# Altium schematic sheet 0272_GPU STRAPS-1.SchDoc
size 848 x 558 mm
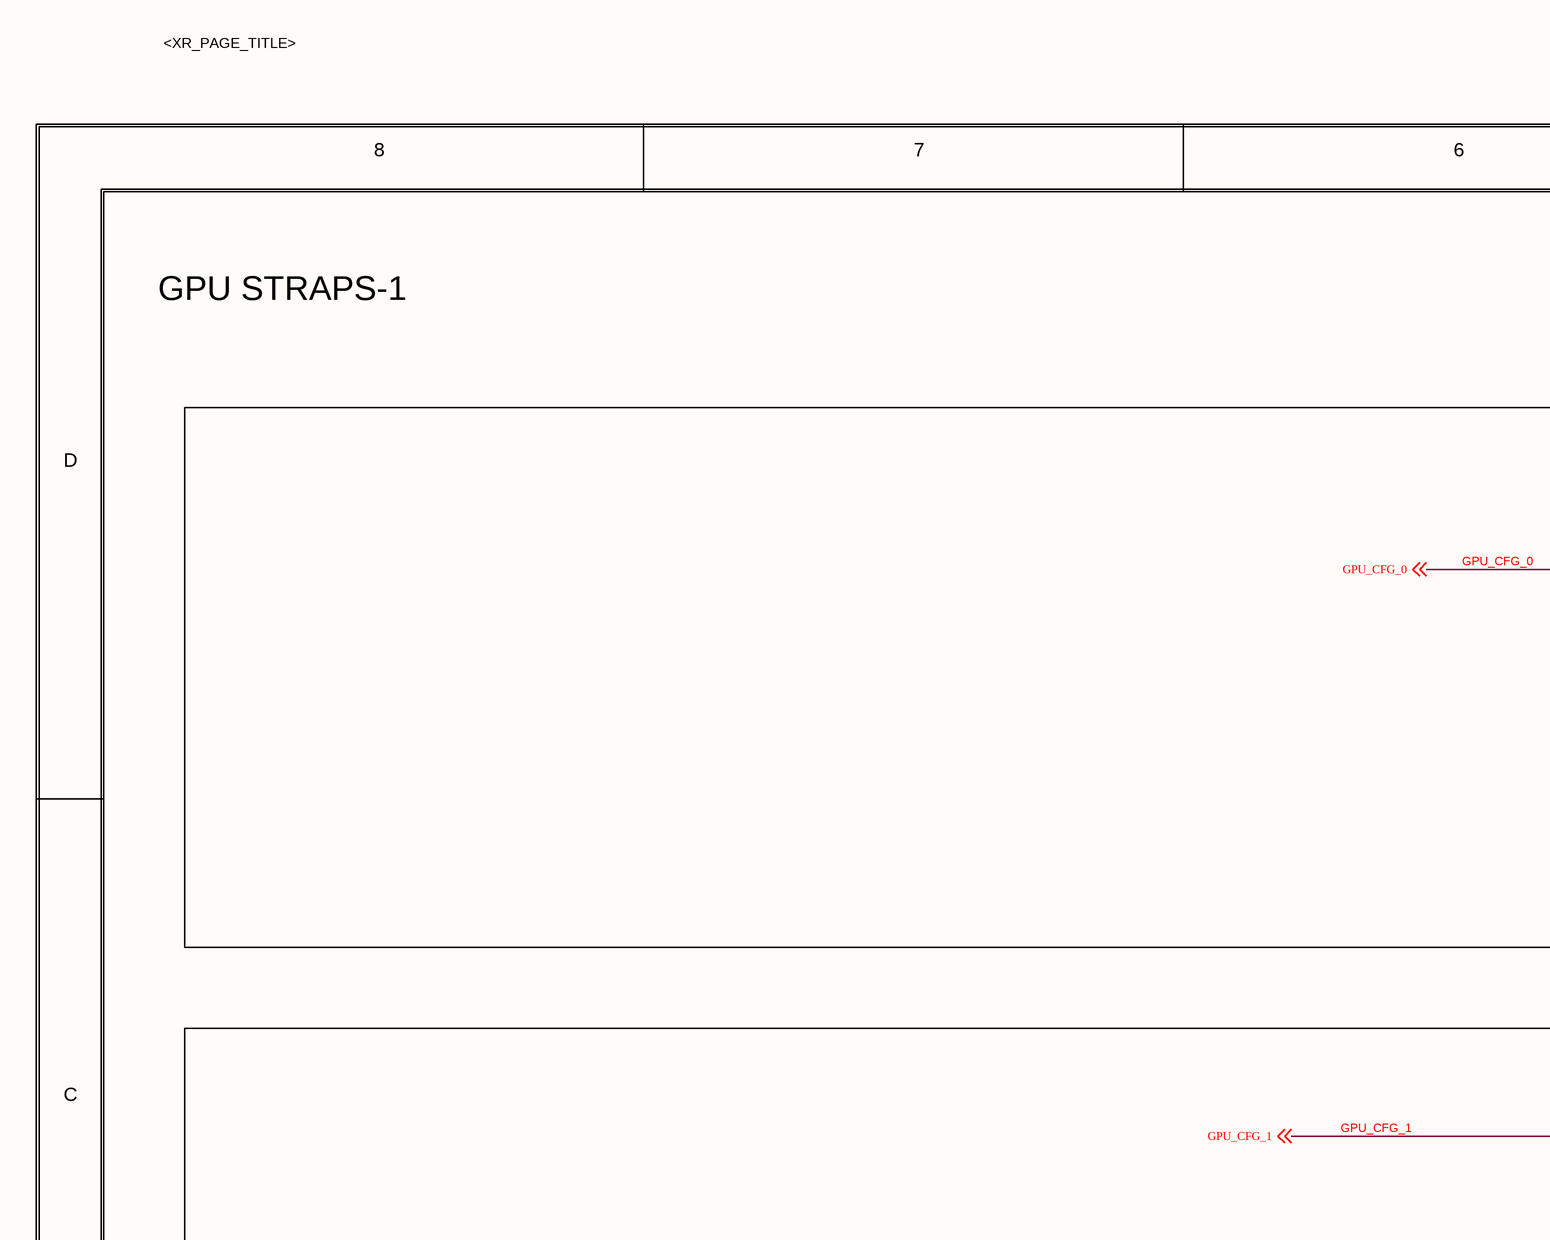
[diagram p0: 0272_GPU STRAPS-1.SchDoc, top left]
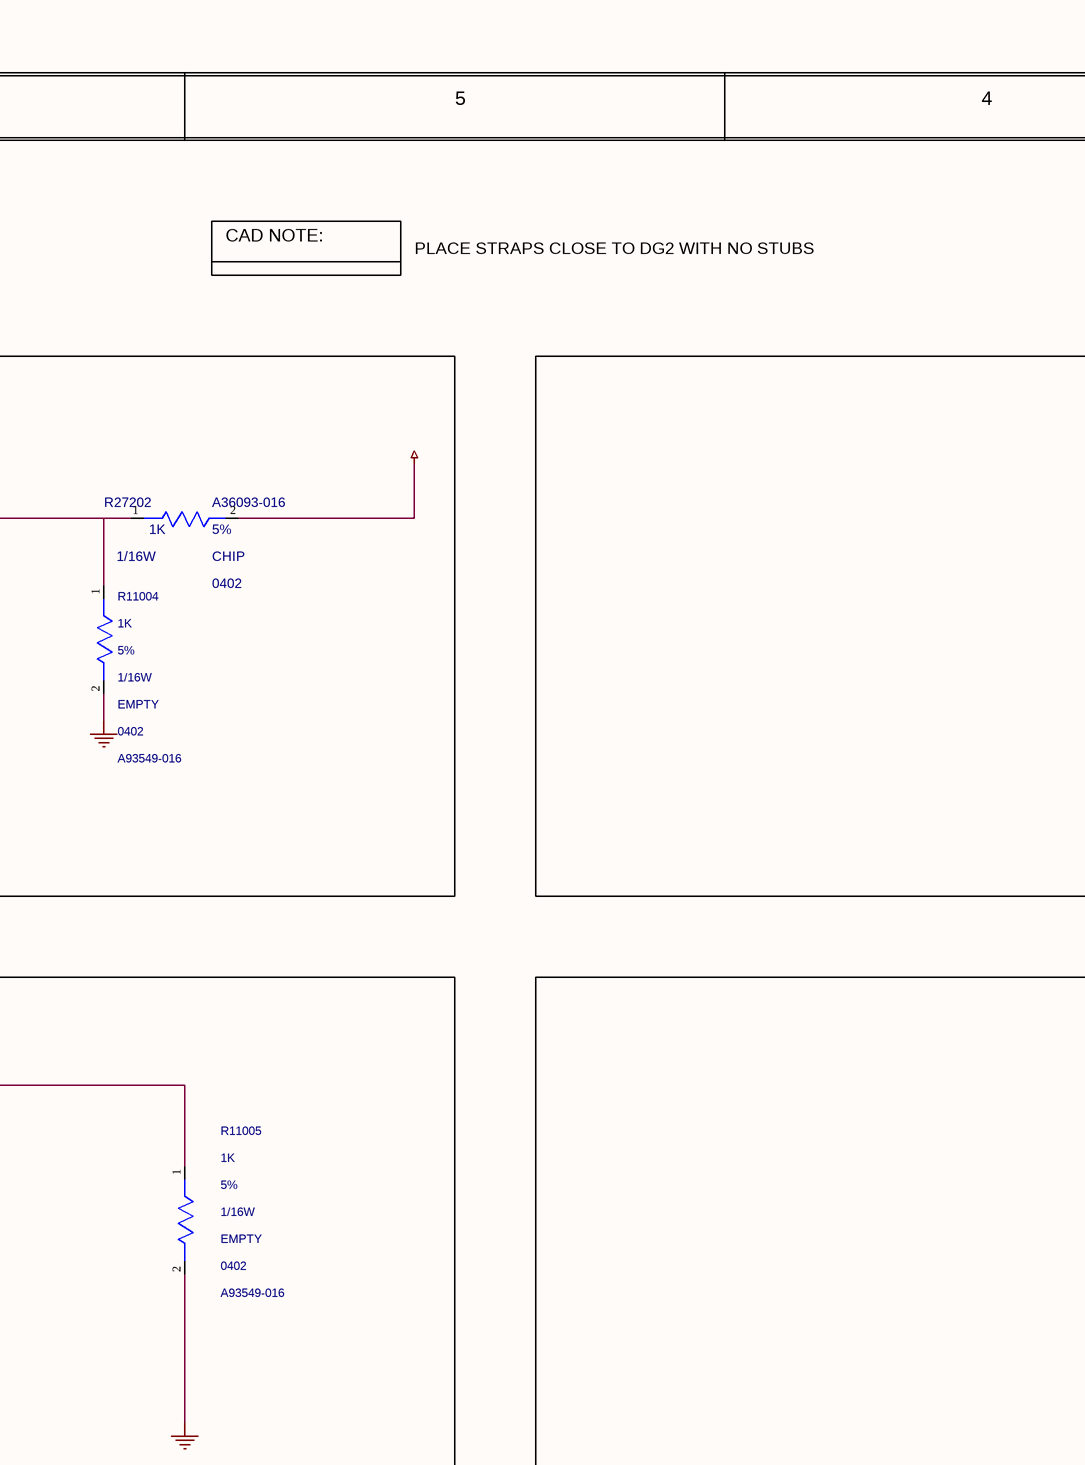
[diagram p1: 0272_GPU STRAPS-1.SchDoc, top middle]
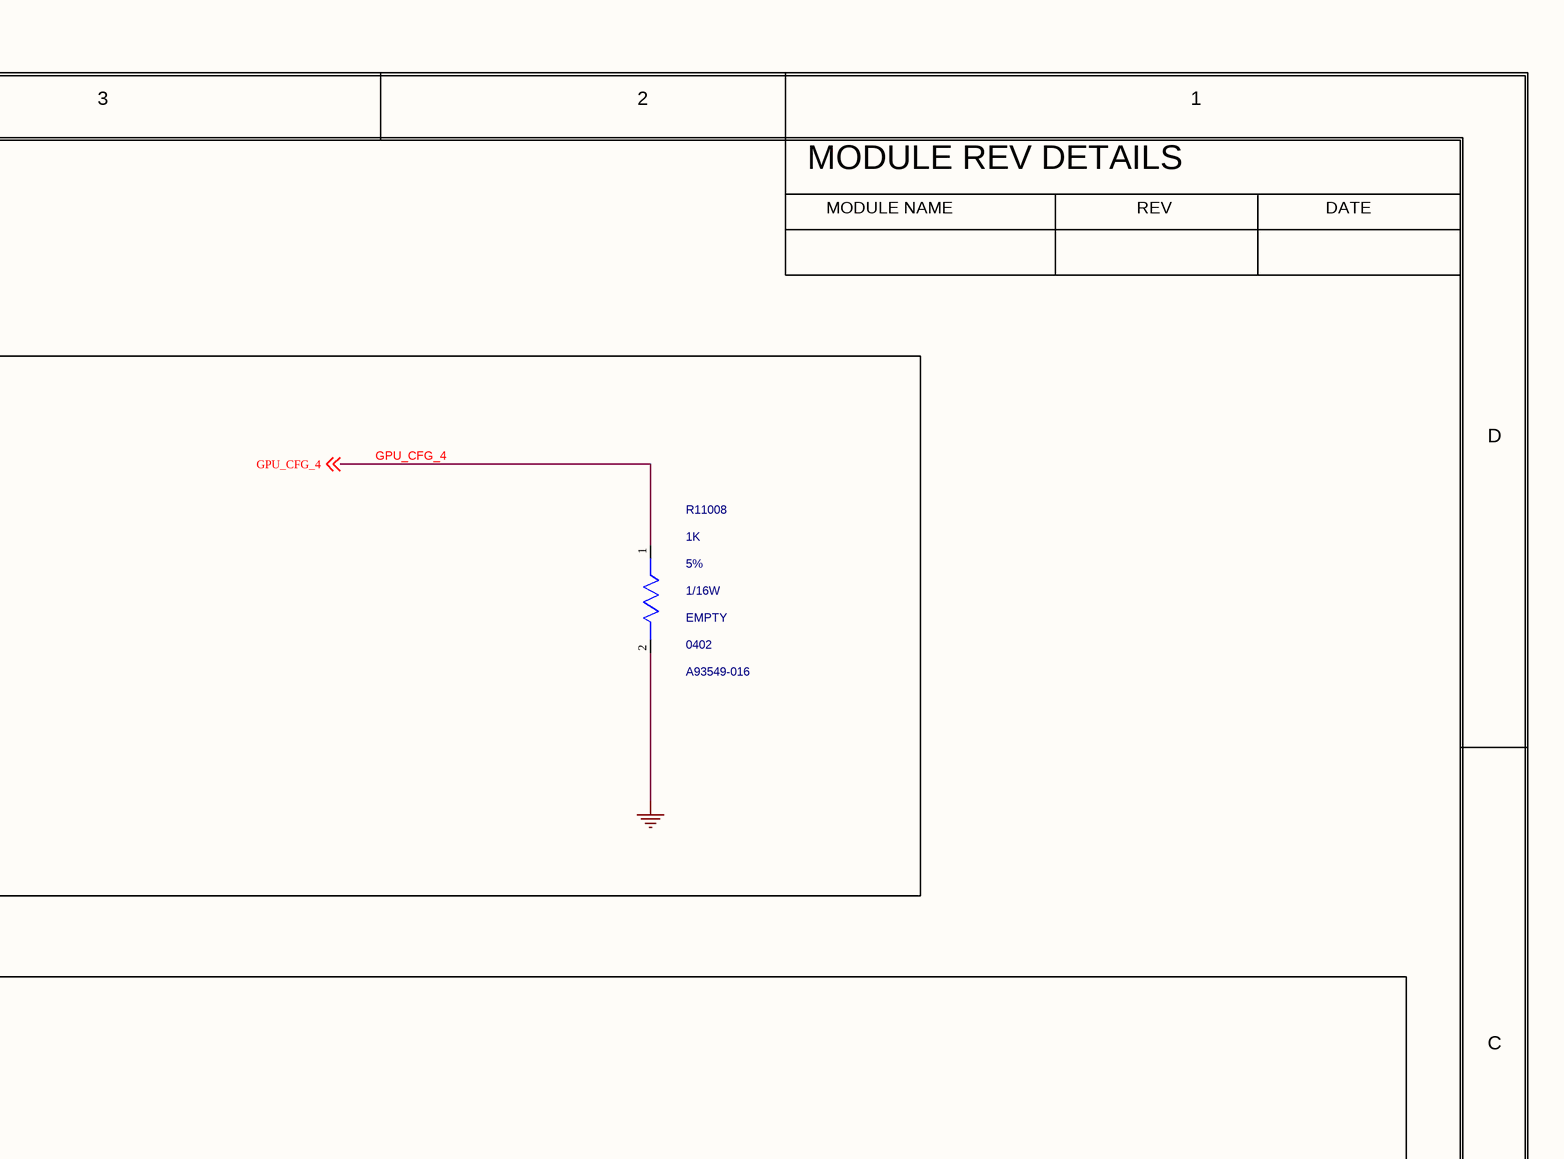
[diagram p2: 0272_GPU STRAPS-1.SchDoc, top right]
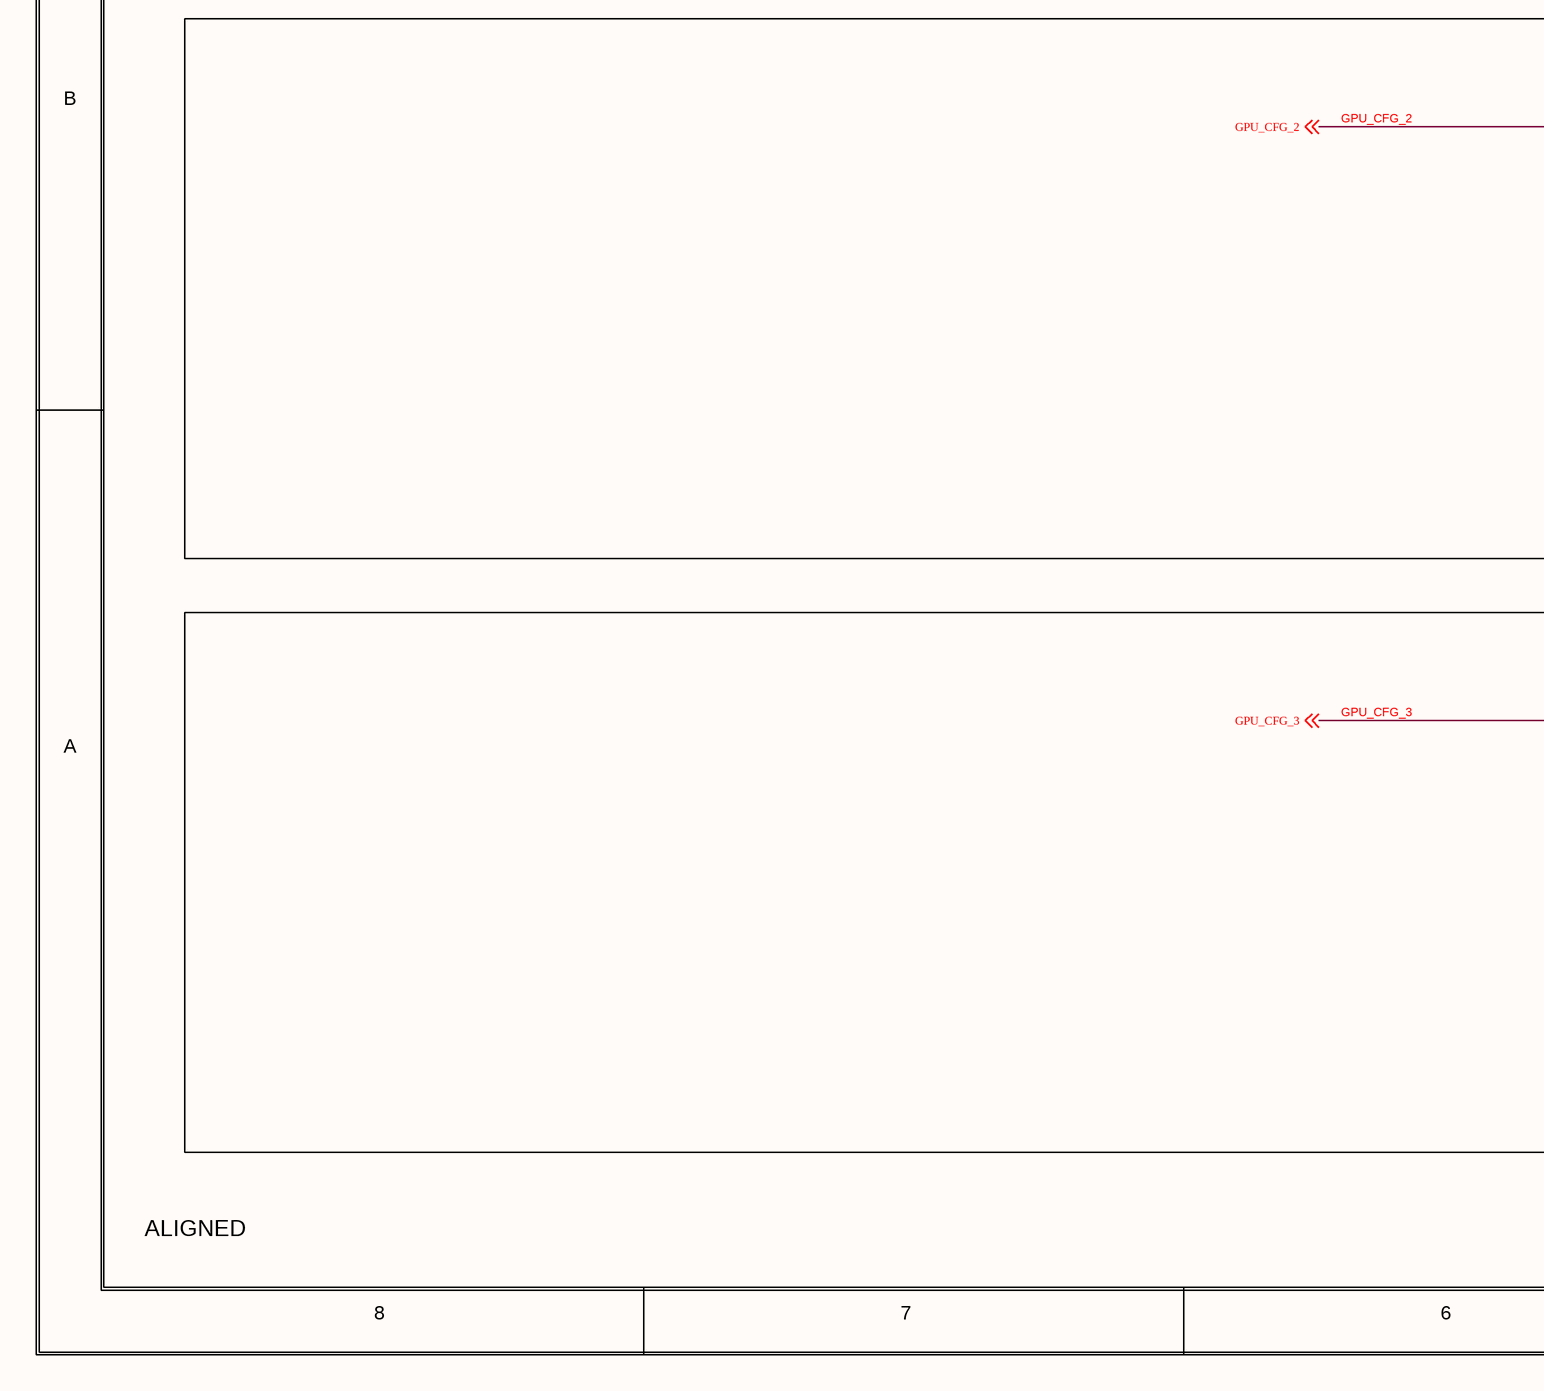
[diagram p3: 0272_GPU STRAPS-1.SchDoc, bottom left]
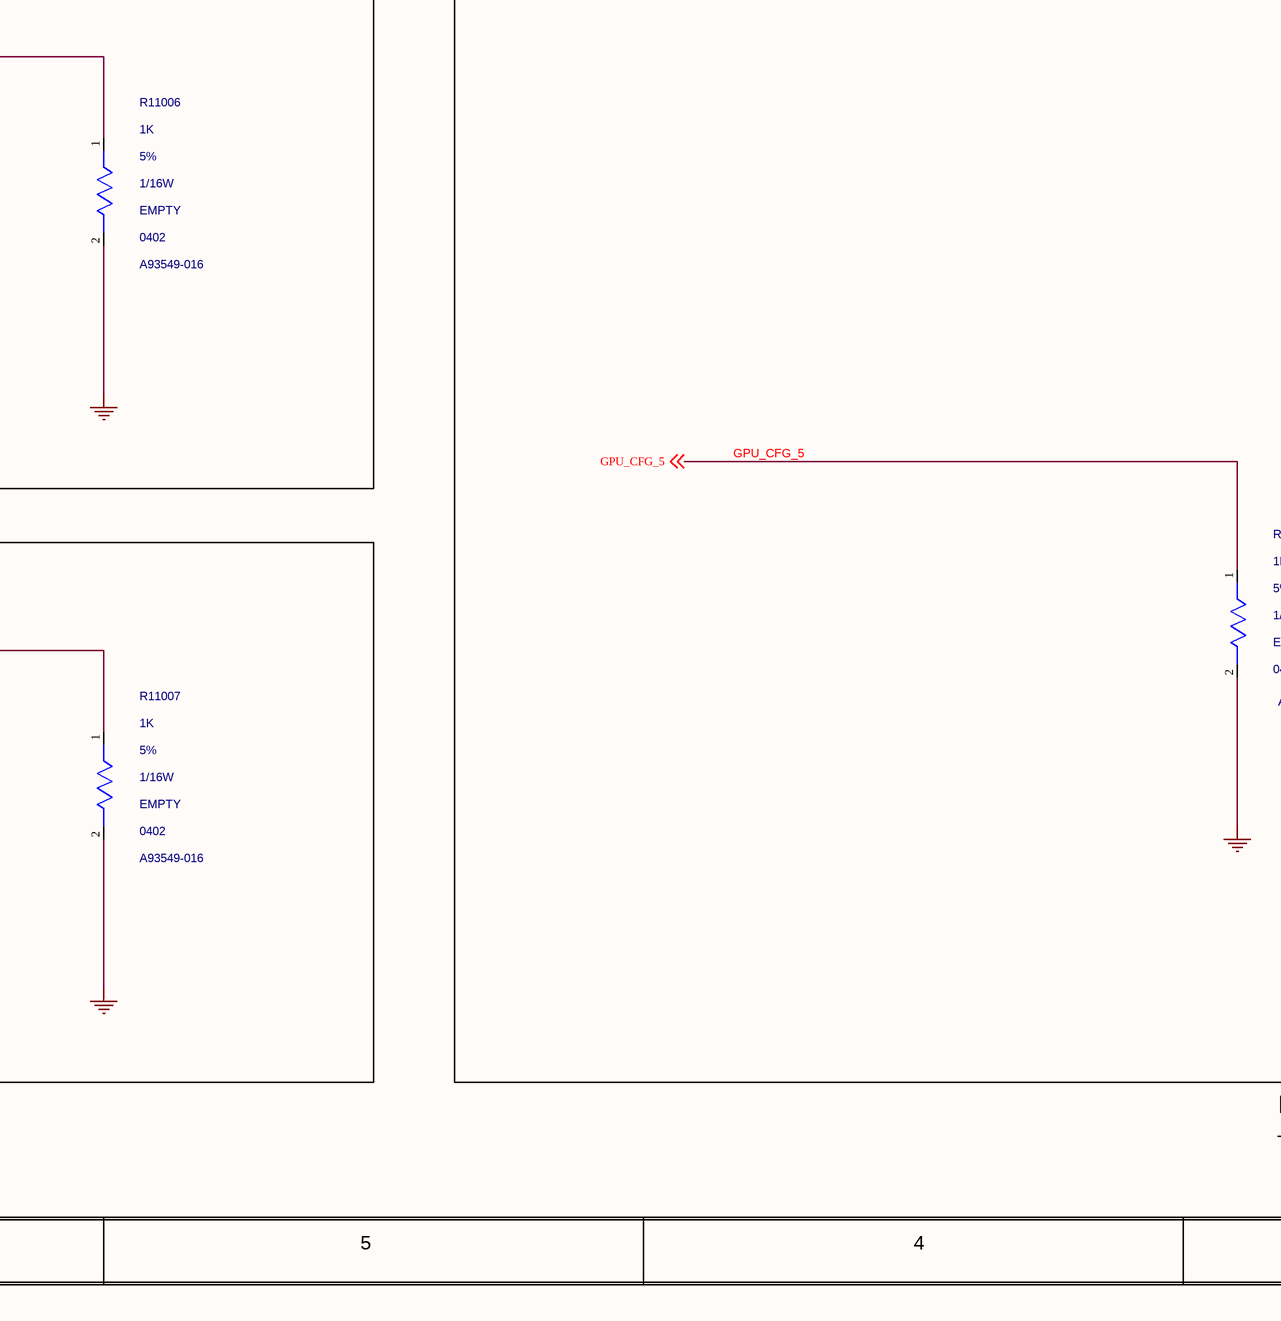
[diagram p4: 0272_GPU STRAPS-1.SchDoc, bottom middle]
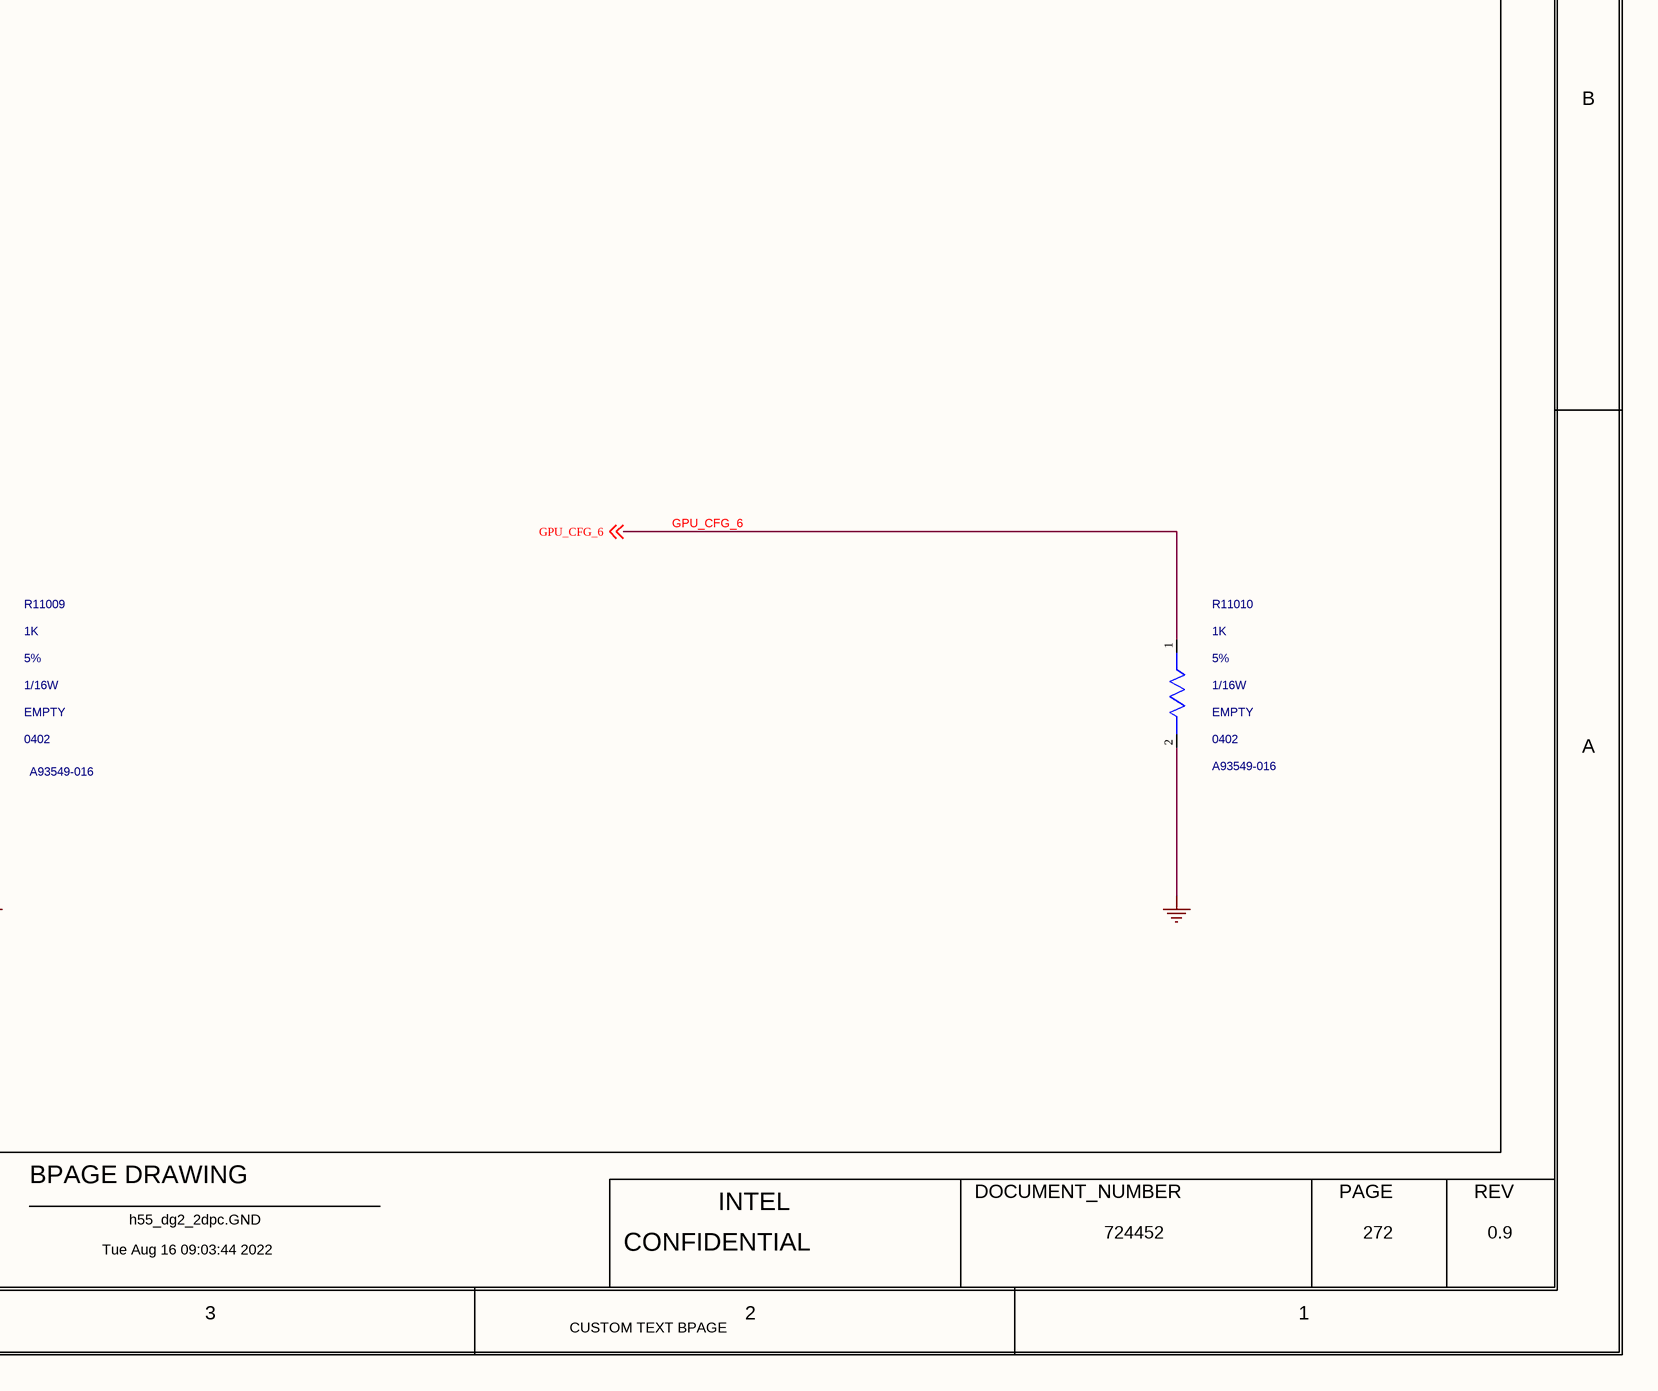
[diagram p5: 0272_GPU STRAPS-1.SchDoc, bottom right]

## Parts
R11004  1K  MATERIAL: EMPTY  PACK_TYPE: 0402  PART_NUMBER: A93549-016  TOLERANCE: 5%  WATTAGE: 1/16W  [SMR0402IA]
R11005  1K  MATERIAL: EMPTY  PACK_TYPE: 0402  PART_NUMBER: A93549-016  TOLERANCE: 5%  WATTAGE: 1/16W  [SMR0402IA]
R11006  1K  MATERIAL: EMPTY  PACK_TYPE: 0402  PART_NUMBER: A93549-016  TOLERANCE: 5%  WATTAGE: 1/16W  [SMR0402IA]
R11007  1K  MATERIAL: EMPTY  PACK_TYPE: 0402  PART_NUMBER: A93549-016  TOLERANCE: 5%  WATTAGE: 1/16W  [SMR0402IA]
R11008  1K  MATERIAL: EMPTY  PACK_TYPE: 0402  PART_NUMBER: A93549-016  TOLERANCE: 5%  WATTAGE: 1/16W  [SMR0402IA]
R11009  1K  MATERIAL: EMPTY  PACK_TYPE: 0402  PART_NUMBER: A93549-016  TOLERANCE: 5%  WATTAGE: 1/16W  [SMR0402IA]
R11010  1K  MATERIAL: EMPTY  PACK_TYPE: 0402  PART_NUMBER: A93549-016  TOLERANCE: 5%  WATTAGE: 1/16W  [SMR0402IA]
R27202  1K  MATERIAL: CHIP  PACK_TYPE: 0402  PART_NUMBER: A36093-016  TOLERANCE: 5%  WATTAGE: 1/16W  [SMR0402IA]

## Nets
+V1P8S_GPU: R27202.2(B)
GND: R11004.2(B) R11005.2(B) R11006.2(B) R11007.2(B) R11008.2(B) R11009.2(B) R11010.2(B)
GPU_CFG_0: R11004.1(A) R27202.1(A) ; off-sheet GPU_CFG_0
GPU_CFG_1: R11005.1(A) ; off-sheet GPU_CFG_1
GPU_CFG_2: R11006.1(A) ; off-sheet GPU_CFG_2
GPU_CFG_3: R11007.1(A) ; off-sheet GPU_CFG_3
GPU_CFG_4: R11008.1(A) ; off-sheet GPU_CFG_4
GPU_CFG_5: R11009.1(A) ; off-sheet GPU_CFG_5
GPU_CFG_6: R11010.1(A) ; off-sheet GPU_CFG_6

## Notes on the sheet
- <XR_PAGE_TITLE>
- 8
- 7
- 6
- 5
- 4
- 3
- 2
- 1
- MODULE REV DETAILS
- GPU STRAPS-1
- CAD NOTE:
- PLACE STRAPS CLOSE TO DG2 WITH NO STUBS
- MODULE NAME
- REV
- DATE
- D
- C
- B
- A
- BPAGE DRAWING
- INTEL
- DOCUMENT_NUMBER
- PAGE
- ALIGNED
- Tue Aug 16 09:03:44 2022
- h55_dg2_2dpc.GND
- CONFIDENTIAL
- 724452
- 272
- 0.9
- CUSTOM TEXT BPAGE

## Library data of the parts
R11004 = RES: CDS_PHYS_PART_NAME: RES_0402-A93549-016,EMPTY,1K,5%,1/16W,LPDB,GENERIC; OriginalSymbolOrigin: (-25,75); XY: (-5150,4075); VER: 2; ROT: 0; PHYS_PAGE: 272; LOCATION: R11004; DRAWING: @RVP1_ADL_SB_ADP_S_DDR5_SODIMM_2DPC_LIB.H55_DG2_2DPC(SCH_1):PAGE445; CDS_LIB: discrete; PCB Footprint: SMR0402IA; CHIPS_PART_NAME: RES; CDS_PART_NAME: RES_0402-A93549-016,EMPTY,1K,5%,1/16W,LPDB,GENERIC; CDS_LOCATION: R11004
R11005 = RES: CDS_PHYS_PART_NAME: RES_0402-A93549-016,EMPTY,1K,5%,1/16W,LPDB,GENERIC; OriginalSymbolOrigin: (-25,75); XY: (-5000,3000); VER: 2; ROT: 0; PHYS_PAGE: 272; LOCATION: R11005; DRAWING: @RVP1_ADL_SB_ADP_S_DDR5_SODIMM_2DPC_LIB.H55_DG2_2DPC(SCH_1):PAGE445; CDS_LIB: discrete; PCB Footprint: SMR0402IA; CHIPS_PART_NAME: RES; CDS_PART_NAME: RES_0402-A93549-016,EMPTY,1K,5%,1/16W,LPDB,GENERIC; CDS_LOCATION: R11005
R11006 = RES: CDS_PHYS_PART_NAME: RES_0402-A93549-016,EMPTY,1K,5%,1/16W,LPDB,GENERIC; OriginalSymbolOrigin: (-25,75); XY: (-5000,1900); VER: 2; ROT: 0; PHYS_PAGE: 272; LOCATION: R11006; DRAWING: @RVP1_ADL_SB_ADP_S_DDR5_SODIMM_2DPC_LIB.H55_DG2_2DPC(SCH_1):PAGE445; CDS_LIB: discrete; PCB Footprint: SMR0402IA; CHIPS_PART_NAME: RES; CDS_PART_NAME: RES_0402-A93549-016,EMPTY,1K,5%,1/16W,LPDB,GENERIC; CDS_LOCATION: R11006
R11007 = RES: CDS_PHYS_PART_NAME: RES_0402-A93549-016,EMPTY,1K,5%,1/16W,LPDB,GENERIC; OriginalSymbolOrigin: (-25,75); XY: (-5000,800); VER: 2; ROT: 0; PHYS_PAGE: 272; LOCATION: R11007; DRAWING: @RVP1_ADL_SB_ADP_S_DDR5_SODIMM_2DPC_LIB.H55_DG2_2DPC(SCH_1):PAGE445; CDS_LIB: discrete; PCB Footprint: SMR0402IA; CHIPS_PART_NAME: RES; CDS_PART_NAME: RES_0402-A93549-016,EMPTY,1K,5%,1/16W,LPDB,GENERIC; CDS_LOCATION: R11007
R11008 = RES: CDS_PHYS_PART_NAME: RES_0402-A93549-016,EMPTY,1K,5%,1/16W,LPDB,GENERIC; OriginalSymbolOrigin: (-25,75); XY: (-1500,4150); VER: 2; ROT: 0; PHYS_PAGE: 272; LOCATION: R11008; DRAWING: @RVP1_ADL_SB_ADP_S_DDR5_SODIMM_2DPC_LIB.H55_DG2_2DPC(SCH_1):PAGE445; CDS_LIB: discrete; PCB Footprint: SMR0402IA; CHIPS_PART_NAME: RES; CDS_PART_NAME: RES_0402-A93549-016,EMPTY,1K,5%,1/16W,LPDB,GENERIC; CDS_LOCATION: R11008
R11009 = RES: CDS_PHYS_PART_NAME: RES_0402-A93549-016,EMPTY,1K,5%,1/16W,LPDB,GENERIC; OriginalSymbolOrigin: (-25,75); XY: (-2900,1100); VER: 2; ROT: 0; PHYS_PAGE: 272; LOCATION: R11009; DRAWING: @RVP1_ADL_SB_ADP_S_DDR5_SODIMM_2DPC_LIB.H55_DG2_2DPC(SCH_1):PAGE445; CDS_LIB: discrete; PCB Footprint: SMR0402IA; CHIPS_PART_NAME: RES; CDS_PART_NAME: RES_0402-A93549-016,EMPTY,1K,5%,1/16W,LPDB,GENERIC; CDS_LOCATION: R11009
R11010 = RES: CDS_PHYS_PART_NAME: RES_0402-A93549-016,EMPTY,1K,5%,1/16W,LPDB,GENERIC; OriginalSymbolOrigin: (-25,75); XY: (-700,1100); VER: 2; ROT: 0; PHYS_PAGE: 272; LOCATION: R11010; DRAWING: @RVP1_ADL_SB_ADP_S_DDR5_SODIMM_2DPC_LIB.H55_DG2_2DPC(SCH_1):PAGE445; CDS_LIB: discrete; PCB Footprint: SMR0402IA; CHIPS_PART_NAME: RES; CDS_PART_NAME: RES_0402-A93549-016,EMPTY,1K,5%,1/16W,LPDB,GENERIC; CDS_LOCATION: R11010
R27202 = RES#1: CHIPS_PART_NAME: RES; CDS_PHYS_PART_NAME: RES_0402-A36093-016,CHIP,1K,5%,1/16W,LPDB,GENERIC; OriginalSymbolOrigin: (-75,25); XY: (-5000,4300); VER: 1; ROT: 0; PHYS_PAGE: 272; LOCATION: R27202; IP: GENERIC; FP_TECH: LPDB; DRAWING: @RVP1_ADL_SB_ADP_S_DDR5_SODIMM_2DPC_LIB.H55_DG2_2DPC(SCH_1):PAGE445; CDS_LIB: discrete; PCB Footprint: SMR0402IA; CDS_PART_NAME: RES_0402-A36093-016,CHIP,1K,5%,1/16W,LPDB,GENERIC; CDS_LOCATION: R27202